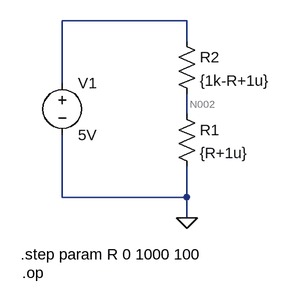
[diagram p0: schematic Voltage_Divider_V001.asc]
Voltage_Divider_V001.asc, the LTspice schematic file:
Version 4
SHEET 1 880 680
WIRE 256 32 64 32
WIRE 256 64 256 32
WIRE 64 128 64 32
WIRE 256 176 256 144
WIRE 64 304 64 208
WIRE 256 304 256 256
WIRE 256 304 64 304
WIRE 256 336 256 304
FLAG 256 336 0
SYMBOL res 240 160 R0
SYMATTR InstName R1
SYMATTR Value {R+1u}
SYMBOL res 240 48 R0
SYMATTR InstName R2
SYMATTR Value {1k-R+1u}
SYMBOL voltage 64 112 R0
WINDOW 123 0 0 Left 0
WINDOW 39 0 0 Left 0
SYMATTR InstName V1
SYMATTR Value 5V
TEXT 0 392 Left 2 !.step param R 0 1000 100
TEXT 2 420 Left 2 !.op

The netlist it stands for:
* Voltage_Divider_V001.asc
R1 N002 0 {R+1u}
R2 N001 N002 {1k-R+1u}
V1 N001 0 5V
.step param R 0 1000 100
.op
.backanno
.end

* Results of the author's LTspice run, read from the files saved beside the schematic
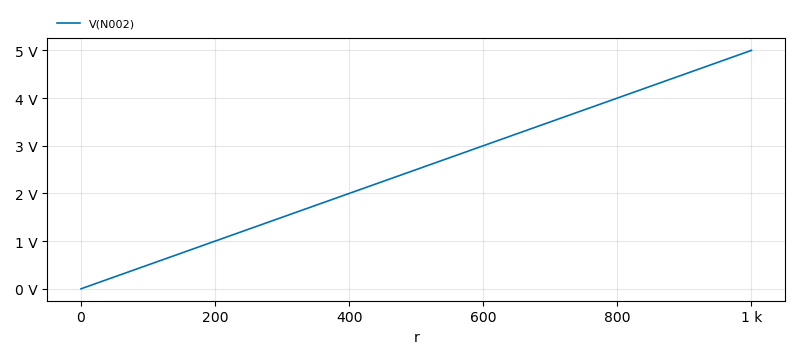
[diagram p1: Operating Point of Voltage_Divider_V001.asc, plotted from the saved traces]
* Operating Point, 1 run:
*   V(N002): 5 nV at r=0, 5 V at r=1 k, min 5 nV, max 5 V